# EAGLE schematic main (EAGLE 7.2.0)
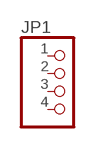
[diagram p0: schematic, sheet 1]

## Parts
JP1  PINHD-1X4  [1X04]
Unconnected: JP1.1 JP1.2 JP1.3 JP1.4

## Library data of the parts
JP1 = pinhead:PINHD-1X4: PIN HEADER